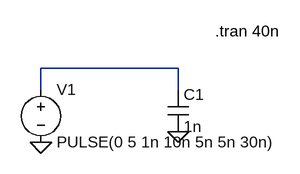
[diagram p0: schematic question8and9.asc]
question8and9.asc, the LTspice schematic file:
Version 4
SHEET 1 880 680
WIRE 240 80 32 80
WIRE 32 112 32 80
WIRE 240 112 240 80
FLAG 32 192 0
FLAG 240 176 0
SYMBOL voltage 32 96 R0
WINDOW 123 0 0 Left 0
WINDOW 39 0 0 Left 0
SYMATTR InstName V1
SYMATTR Value PULSE(0 5 1n 10n 5n 5n 30n)
SYMBOL cap 224 112 R0
SYMATTR InstName C1
SYMATTR Value 1n
TEXT 296 24 Left 2 !.tran 40n

The netlist it stands for:
* question8and9.asc
V1 N001 0 PULSE(0 5 1n 10n 5n 5n 30n)
C1 N001 0 1n
.tran 40n
.backanno
.end